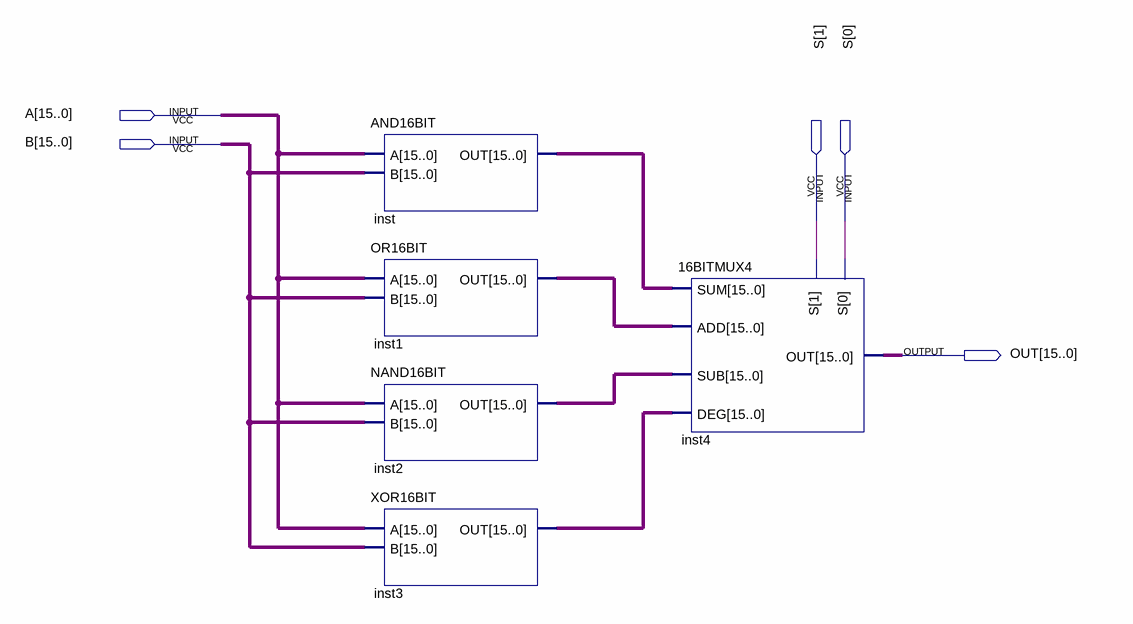
[diagram p0: schematic sheet]
// Quartus schematic LU.bdf as structural Verilog: 5 symbols, 5 pins
module LU (
  input  [15:0] A,
  input  [15:0] B,
  input  [1:0] S,
  output [15:0] OUT
);

  wire [15:0] inst1_out, inst2_out, inst3_out, inst_out;

  AND16BIT inst (.A(A), .B(B), .OUT(inst_out));
  OR16BIT inst1 (.A(A), .B(B), .OUT(inst1_out));
  NAND16BIT inst2 (.A(A), .B(B), .OUT(inst2_out));
  XOR16BIT inst3 (.A(A), .B(B), .OUT(inst3_out));
  \16BITMUX4  inst4 (.SUM(inst_out), .SUB(inst2_out), .ADD(inst1_out), .DEG(inst3_out), .S(S), .OUT(OUT));
endmodule
